# EAGLE design wsmodule (EAGLE 8.2.2)
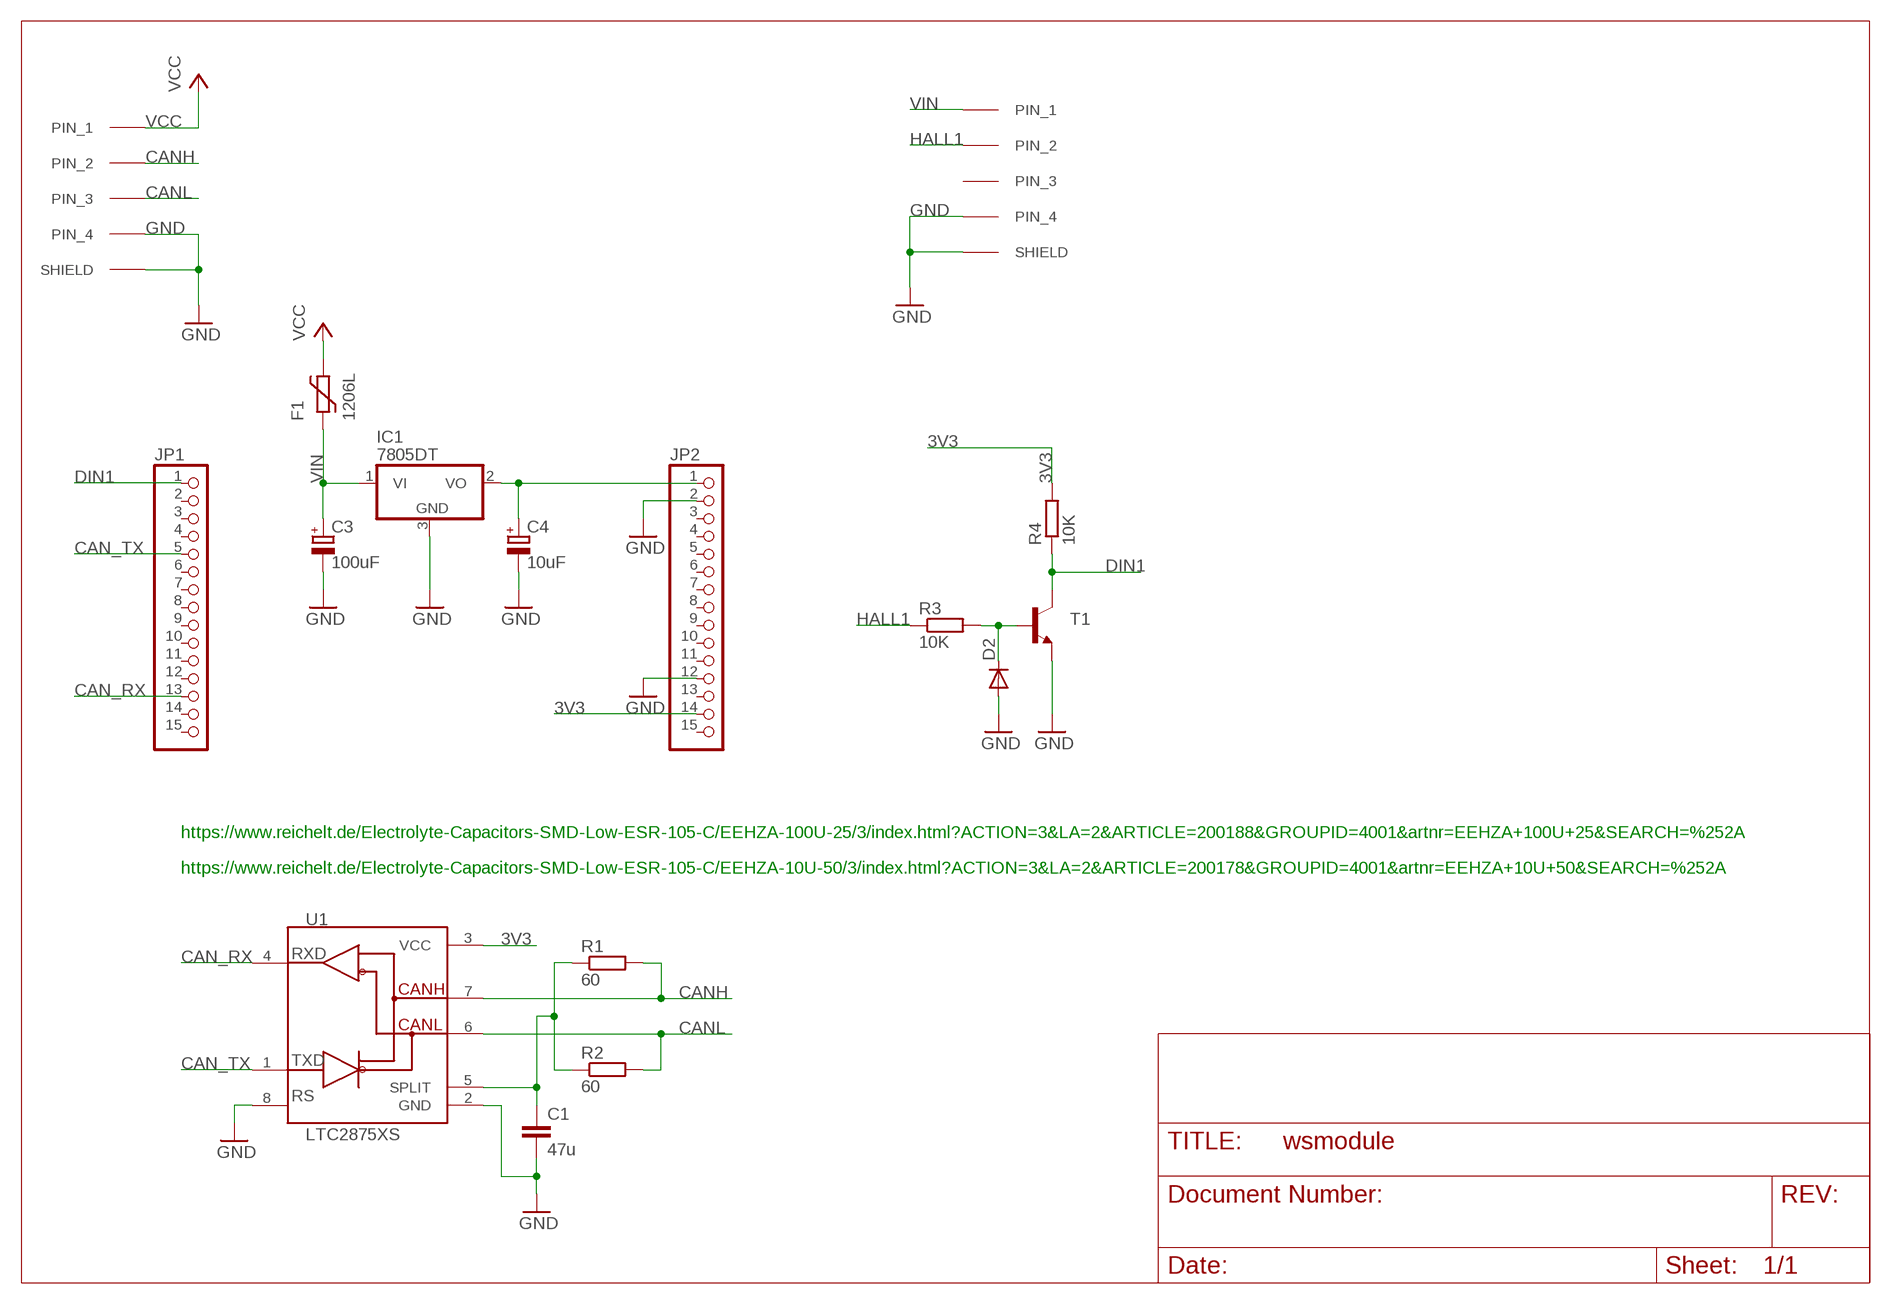
[diagram p0: schematic, sheet 1]

## Parts
C1  47u  CC1210  [C1210]
C3  100uF  CPOL-EUD  [PANASONIC_D]
C4  10uF  CPOL-EUC  [PANASONIC_C]
D2  DIODE-GF1  [GF1]
F1  1206L  [1206L]
IC1  7805DT  [TO252]
INPUT  M8-718-MALE  [M18-718-MALE]
JP1  PINHD-1X15  [1X15]
JP2  PINHD-1X15  [1X15]
OUTPUT  M8-718-FEMALE  [M18-718-FEMALE]
R1  60  RR1206  [R1206]
R2  60  RR1206  [R1206]
R3  10K  RR1206  [R1206]
R4  10K  RR1206  [R1206]
T1  BC849  [SOT23]
U1  LTC2875XS  [SO-08]

## Nets
3V3: JP2.14 R4.2 U1.3(VCC)
5V: C4.+ IC1.2(VO) JP2.1
CAN_RX: JP1.13 U1.4(RXD)
CAN_TX: JP1.5 U1.1(TXD)
CANH: INPUT.P$2(PIN_2) R1.2 U1.7(CANH)
CANL: INPUT.P$3(PIN_3) R2.2 U1.6(CANL)
DIN1: JP1.1 R4.1 T1.3(C)
GND: C1.2 C3.- C4.- D2.A IC1.3(GND) INPUT.L(SHIELD) INPUT.P$4(PIN_4) INPUT.R(SHIELD) JP2.2 JP2.12 OUTPUT.L(SHIELD) OUTPUT.P$4(PIN_4) OUTPUT.R(SHIELD) T1.2(E) U1.2(GND) U1.8(RS1)
HALL1: OUTPUT.P$2(PIN_2) R3.1
N$1: D2.C R3.2 T1.1(B)
N$3: C1.1 R1.1 R2.1 U1.5(SPLIT)
VCC: F1.P$2 INPUT.P$1(PIN_1)
VIN: C3.+ F1.P$1 IC1.1(VI) OUTPUT.P$1(PIN_1)
Unconnected: JP1.2 JP1.3 JP1.4 JP1.6 JP1.7 JP1.8 JP1.9 JP1.10 JP1.11 JP1.12 JP1.14 JP1.15 JP2.3 JP2.4 JP2.5 JP2.6 JP2.7 JP2.8 JP2.9 JP2.10 JP2.11 JP2.13 JP2.15 OUTPUT.P$3(PIN_3)

## Notes on the sheet
- https://www.reichelt.de/Electrolyte-Capacitors-SMD-Low-ESR-105-C/EEHZA-100U-25/3/index.html?ACTION=3&LA=2&ARTICLE=200188&GROUPID=4001&artnr=EEHZA+100U+25&SEARCH=%252A
- https://www.reichelt.de/Electrolyte-Capacitors-SMD-Low-ESR-105-C/EEHZA-10U-50/3/index.html?ACTION=3&LA=2&ARTICLE=200178&GROUPID=4001&artnr=EEHZA+10U+50&SEARCH=%252A

## Library data of the parts
C1 = eagle-ltspice:C: CAPACITOR, European symbol; SPICEMODEL: NONE; SPICEPREFIX: C
C3 C4 = rcl:CPOL-EU: POLARIZED CAPACITOR, European symbol
D2 = diode:DIODE-: DIODE
F1 = ptc-littlefuse:1206L
IC1 = linear:78*: Positive VOLTAGE REGULATOR Source: http://cache.national.com/ds/LM/LM78L05.pdf http://www.fairchildsemi.com/ds/LM/LM7805.pdf
INPUT = SamacSys_Parts:M8-718-MALE
JP1 JP2 = pinhead:PINHD-1X15: PIN HEADER
OUTPUT = SamacSys_Parts:M8-718-FEMALE
R1-R4 = eagle-ltspice:R: RESISTOR, European symbol; SPICEMODEL: NONE; SPICEPREFIX: R
T1 = transistor:BC849: NPN TRANSISTOR
U1 = borkedlabs-transceivers:LTC2875: 3.3V/5V CAN Transceiver

## Board
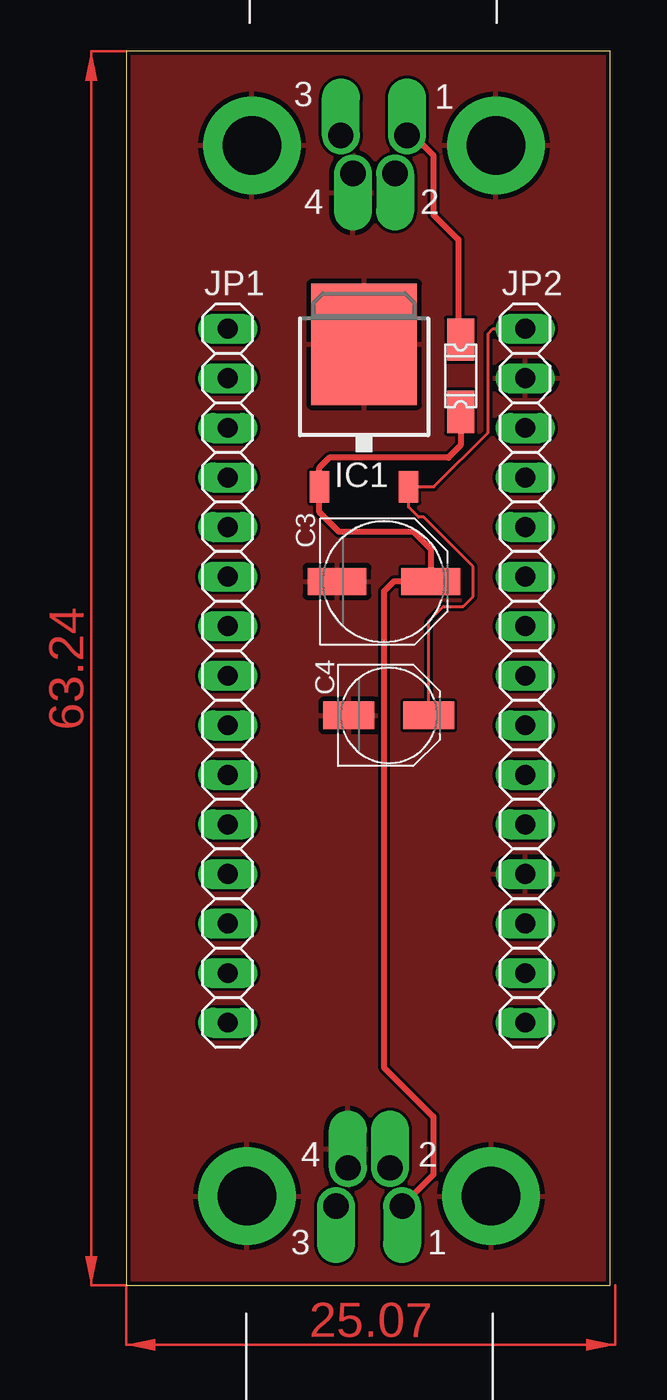
[diagram p1: board, top side]
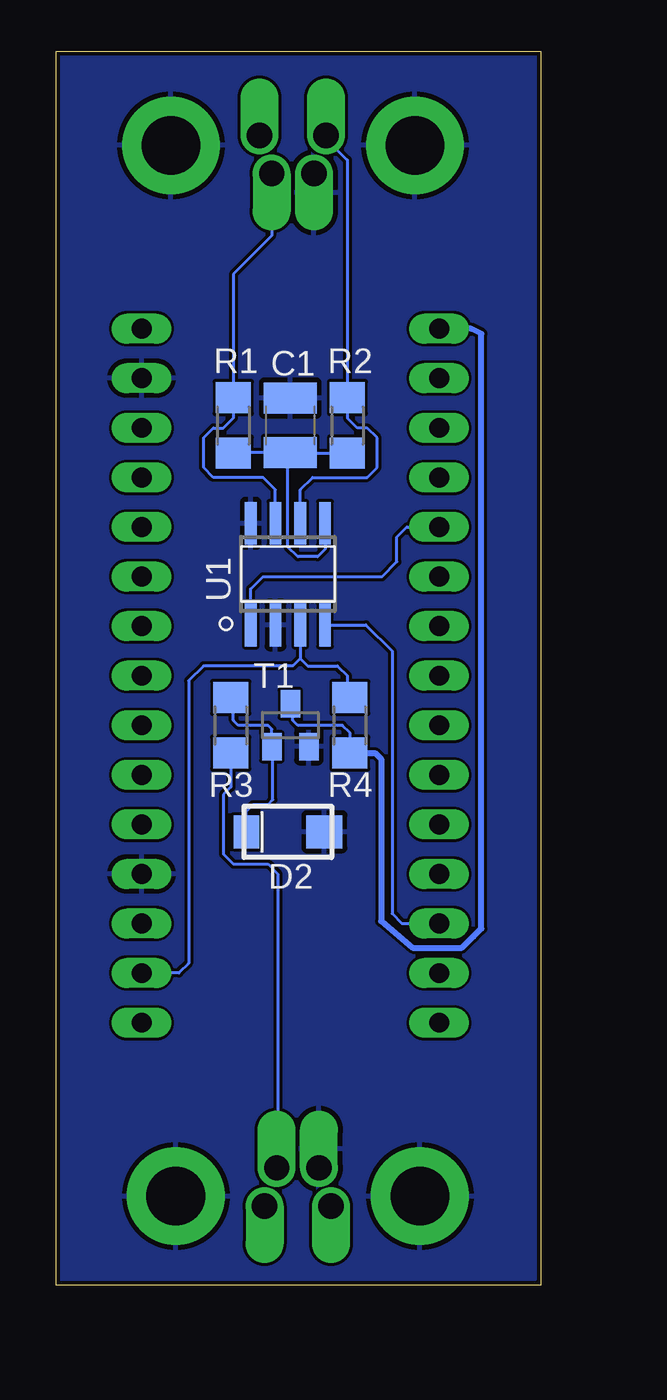
[diagram p2: board, bottom side, seen from below]

Size 24.82 x 63.24 mm. Coordinates in mm from the lower left corner, seen from the top.
Outline: 0,0 24.82,0 24.82,63.24 0,63.24 0,0
Copper layers (1*16): Top 0.035mm / dielectric 1.5mm / Bottom 0.035mm
Design rules "Fischer LP_2013": minimum track width 0.15mm, minimum drill 0.3mm, track to track 6mil, track to pad 6mil, pad to pad 6mil, via to via 6mil, smd to smd 6mil, copper to edge 0.2mm, drill to drill 8mil, minimum pad ring 0.15mm, minimum via ring 0.15mm, stop-mask expansion 4mil, vias tented up to drill 0mil, thermal gap 10mil

### Footprints (pad centres in the part's own frame; a part is rotated, then mirrored left to right if it is on the bottom)
C1210 = smd 1.6 x 2.7: 1 -1.4,0; 2 1.4,0
PANASONIC_D = smd 3 x 1.4: + 2.4,0; - -2.4,0
PANASONIC_C = smd 2.6 x 1.4: + 2.05,0; - -2.05,0
GF1 = smd 1.85 x 1.68: A 1.87,0 | smd 1.32 x 1.68: C -2.12,0
1206L = smd 2.16 x 1.4: P$1 -1.85,0; P$2 1.85,0
TO252 = smd 1 x 1.6: 1 -2.28,-4.8; 2 2.28,-4.8 | smd 5.4 x 6.2: 3 0,2.5
M18-718-MALE = drill 3 pad 5: L -6.25,0; R 6.25,0 | drill 1.3 pad 1.8 offset: P$1 -1.7,-0.5; P$2 -1.08,1.45; P$3 1.7,-0.5; P$4 1.08,1.45
1X15 = drill 1.016 long: 1 -17.78,0; 2 -15.24,0; 3 -12.7,0; 4 -10.16,0; 5 -7.62,0; 6 -5.08,0; 7 -2.54,0; 8 0,0; 9 2.54,0; 10 5.08,0; 11 7.62,0; 12 10.16,0; 13 12.7,0; 14 15.24,0; 15 17.78,0
M18-718-FEMALE = drill 3 pad 5: L -6.25,0; R 6.25,0 | drill 1.3 pad 1.8 offset: P$1 1.7,-0.5; P$2 1.08,1.45; P$3 -1.7,-0.5; P$4 -1.08,1.45
R1206 = smd 1.6 x 1.803: 1 -1.422,0; 2 1.422,0
SOT23 = smd 1 x 1.4: 1 -0.95,-1.1; 2 0.95,-1.1; 3 0,1.1
SO-08 = smd 0.6 x 2.2: 1 -1.905,-2.6; 2 -0.635,-2.6; 3 0.635,-2.6; 4 1.905,-2.6; 5 1.905,2.6; 6 0.635,2.6; 7 -0.635,2.6; 8 -1.905,2.6

### Placement (x,y rotation side)
C1  12.83,44.07 90 bottom
C3  13.21,36.07 0 top
C4  13.46,29.21 0 top
D2  12.95,23.24 0 bottom
F1  17.14,46.61 90 top
IC1  12.19,45.72 0 top
INPUT  12.7,58.42 180 top
JP1  5.21,31.24 270 top
JP2  20.45,31.24 270 top
OUTPUT  12.45,4.57 0 top
R1  15.75,44.07 90 bottom
R2  9.91,44.07 90 bottom
R3  15.88,28.7 90 bottom
R4  9.78,28.7 90 bottom
T1  12.83,28.7 0 bottom
U1  12.95,36.45 0 bottom

### Tracks (layer width: path | path; a pad name or v marks a point on that pad's centre or on a via)
3V3
  Bottom 0.152: U1.3 12.32,32.13 | 12.32,32.13 11.94,31.75 10.41,31.75 9.91,31.24 9.91,30.25 R4.2 | 12.32,32.13 12.7,31.75 17.27,31.75 18.03,30.99 18.03,16.51 18.54,16 JP2.14
5V
  Top 0.152: C4.+ 15.51,34.05 16.26,34.8 17.27,34.8 17.78,35.31 17.78,36.83 15.24,39.37 14.99,39.37 14.48,39.88 IC1.2 15.77,40.92 18.54,43.69 18.54,48.77 18.8,49.02 JP2.1
CAN_RX
  Bottom 0.152: U1.4 8.96,33.85 7.62,32.51 7.62,19.05 7.11,18.54 JP1.13
CAN_TX
  Bottom 0.152: U1.1 14.86,35.69 14.22,36.32 8.13,36.32 7.37,37.08 7.37,38.35 6.86,38.86 JP1.5
CANH
  Bottom 0.152: U1.7 13.59,40.77 14.22,41.4 16.76,41.4 17.27,41.91 17.27,43.43 16.76,43.94 16.26,43.94 15.75,44.45 15.75,45.44 | 15.75,45.44 R1.2 | INPUT.P$2 13.78,53.78 15.75,51.82 15.75,45.44
CANL
  Bottom 0.152: U1.6 12.32,40.77 11.68,41.4 8.89,41.4 8.38,41.91 8.38,43.43 8.89,43.94 9.4,43.94 9.91,44.45 9.91,45.44 | 9.91,45.44 R2.2 | INPUT.P$3 11,58.75 9.91,57.66 9.91,45.44
DIN1
  Bottom 0.152: R4.1 9.78,28.32 10.16,28.7 12.45,28.7 12.7,28.96 12.7,29.68 T1.3 | 3.45,17.88
  Bottom 0.305: R4.1 8.48,27.28 8.18,26.98 8.18,18.67 6.55,17.3 4.04,17.3 3.45,17.88 | 3.45,17.88 3.05,18.29 3.05,48.77 3.56,49.02 JP1.1
GND
  pour Bottom: 0.32,0.32 24.77,0.25 24.77,63.18 0.06,63.18
  pour Top: 0.32,0.32 24.77,0.25 24.77,63.18 0.06,63.18
HALL1
  Bottom 0.152: R3.1 15.88,25.53 16.26,25.15 16.26,22.1 15.75,21.59 13.97,21.59 13.46,21.08 13.46,6.09 OUTPUT.P$2
N$1
  Bottom 0.152: R3.2 15.75,30 15.75,28.96 15.49,28.7 13.97,28.7 13.78,28.51 T1.1 13.72,27.54 13.72,24.89 13.97,24.64 14.73,24.64 15.07,24.3 D2.C
N$3
  Bottom 0.152: 12.8,42.65 R2.1 | C1.1 12.8,42.65 | C1.1 15.73,42.67 R1.1 | 12.95,42.5 12.8,42.65 | U1.5 11.05,37.72 11.43,37.34 12.45,37.34 12.95,37.85 12.95,42.54 C1.1
VCC
  Top 0.305: INPUT.P$1 14.74,58.92 15.75,57.91 15.75,54.86 17.02,53.59 17.02,48.59 F1.P$2
VIN
  Top 0.305: F1.P$1 17.14,43.05 16.51,42.42 10.41,42.42 9.91,41.91 IC1.1 | IC1.1 | IC1.1 9.91,39.62 10.92,38.61 14.73,38.61 15.61,37.73 C3.+ 13.72,36.07 13.21,35.56 13.21,11.18 15.75,8.64 15.75,5.67 OUTPUT.P$1
(copper drawn outside any net)
  shapes: Top area x2